# EAGLE design schemat_manipulatora_MTS (EAGLE 9.6.2)
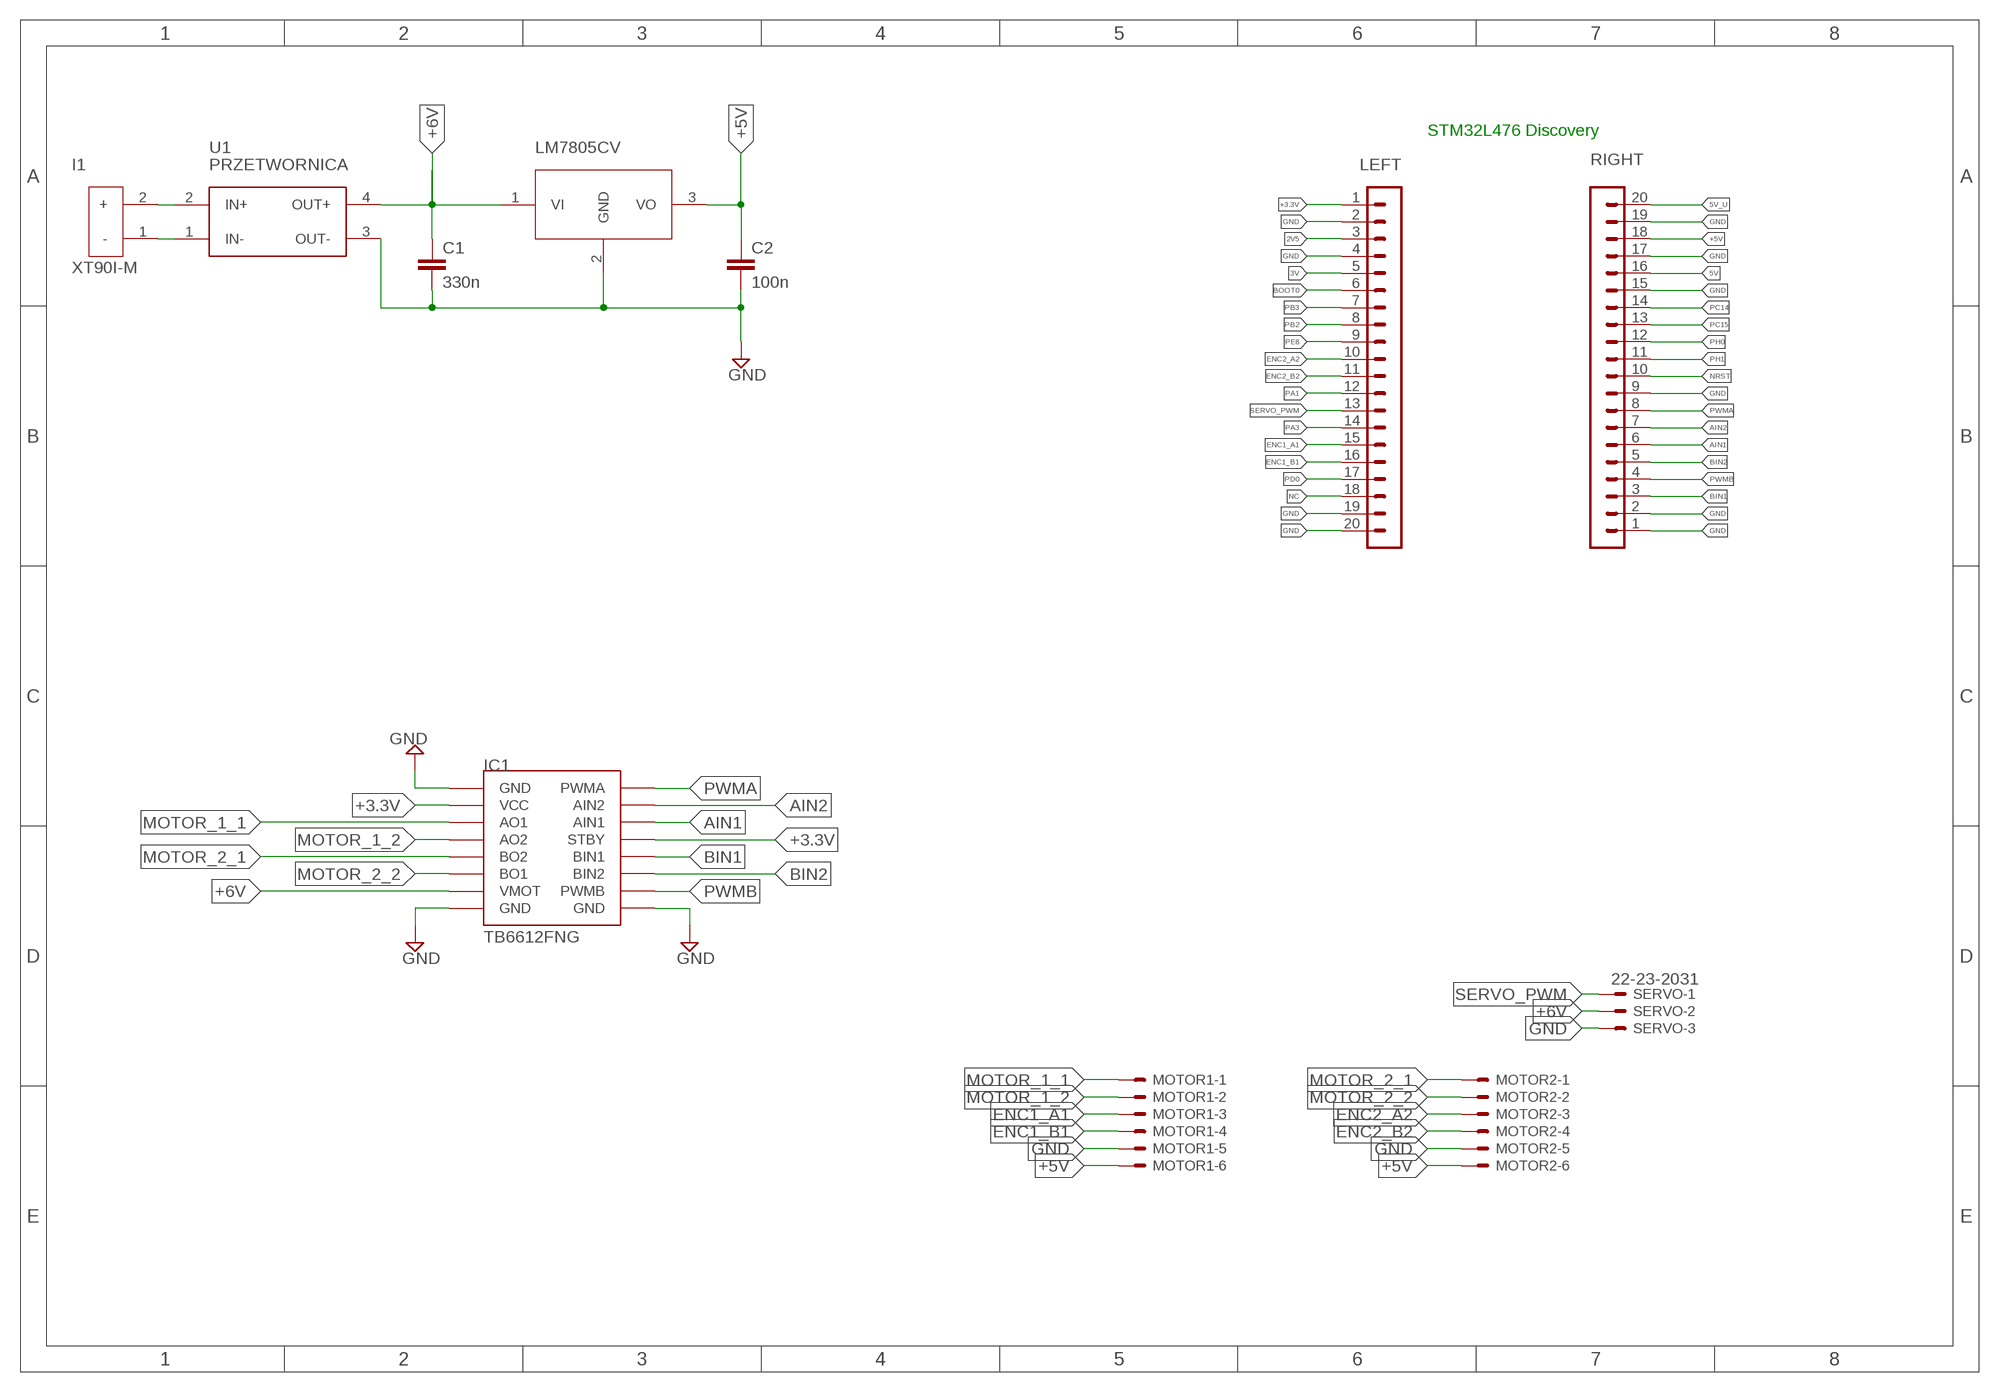
[diagram p0: schematic, sheet 1]

## Parts
C1  330n  C-EU025-024X044  [C025-024X044]
C2  100n  C-EU025-024X044  [C025-024X044]
I1  XT90I-M  [XT90I-M]
IC1  MODUL_POLOLU  [MODUL_POLOLU]
LEFT  MA20-1  [MA20-1]
LM7805CV  LM7805CV  [TO220V]
MOTOR1  22-23-2061  [22-23-2061]
MOTOR2  22-23-2061  [22-23-2061]
RIGHT  MA20-1  [MA20-1]
SERVO  22-23-2031  [22-23-2031]
U1  PRZETWORNICA  [BUCK_MODULE]

## Nets
2V5: LEFT.3
3V: LEFT.5
5V: RIGHT.16
5V_U: RIGHT.20
+3.3V: IC1.STBY IC1.VCC LEFT.1
+5V: C2.1 LM7805CV.3(VO) MOTOR1.6 MOTOR2.6 RIGHT.18
+6V: C1.1 IC1.VMOT LM7805CV.1(VI) SERVO.2 U1.4(OUT+)
AIN1: IC1.AIN1 RIGHT.6
AIN2: IC1.AIN2 RIGHT.7
BIN1: IC1.BIN1 RIGHT.3
BIN2: IC1.BIN2 RIGHT.5
BOOT0: LEFT.6
ENC1_A1: LEFT.15 MOTOR1.3
ENC1_B1: LEFT.16 MOTOR1.4
ENC2_A2: LEFT.10 MOTOR2.3
ENC2_B2: LEFT.11 MOTOR2.4
GND: C1.2 C2.2 IC1.GND1(GND) IC1.GND2(GND) IC1.GND3(GND) LEFT.2 LEFT.4 LEFT.19 LEFT.20 LM7805CV.2(GND) MOTOR1.5 MOTOR2.5 RIGHT.1 RIGHT.2 RIGHT.9 RIGHT.15 RIGHT.17 RIGHT.19 SERVO.3 U1.3(OUT-)
MOTOR_1_1: IC1.AO1 MOTOR1.1
MOTOR_1_2: IC1.A02(AO2) MOTOR1.2
MOTOR_2_1: IC1.BO2 MOTOR2.1
MOTOR_2_2: IC1.BO1 MOTOR2.2
N$1: I1.2(+) U1.2(IN+)
N$2: I1.1(-) U1.1(IN-)
NC: LEFT.18
NRST: RIGHT.10
PA1: LEFT.12
PA3: LEFT.14
PB2: LEFT.8
PB3: LEFT.7
PC14: RIGHT.14
PC15: RIGHT.13
PD0: LEFT.17
PE8: LEFT.9
PH0: RIGHT.12
PH1: RIGHT.11
PWMA: IC1.PWMA RIGHT.8
PWMB: IC1.PWMB RIGHT.4
SERVO_PWM: LEFT.13 SERVO.1

## Notes on the sheet
- STM32L476 Discovery

## Library data of the parts
C1 C2 = rcl:C-EU: CAPACITOR, European symbol; SPICEPREFIX: C
I1 = amy_library:XT90I-M
IC1 = TB6612FNG:MODUL_POLOLU
LEFT RIGHT = con-lstb:MA20-1: PIN HEADER; OC_FARNELL: unknown; OC_NEWARK: unknown
LM7805CV = LM:LM7805CV
MOTOR1 MOTOR2 = con-molex:22-23-2061: .100" (2.54mm) Center Header - 6 Pin; MF: MOLEX; MPN: 22-23-2061; OC_FARNELL: 1462922; OC_NEWARK: 27C1933
SERVO = con-molex:22-23-2031: .100" (2.54mm) Center Header - 3 Pin; MF: MOLEX; MPN: 22-23-2031; OC_FARNELL: 1462950; OC_NEWARK: 30C0862
U1 = LM:PRZETWORNICA

## Module PRZETWORNICA
Ports: 

### Library data of the parts

## Board
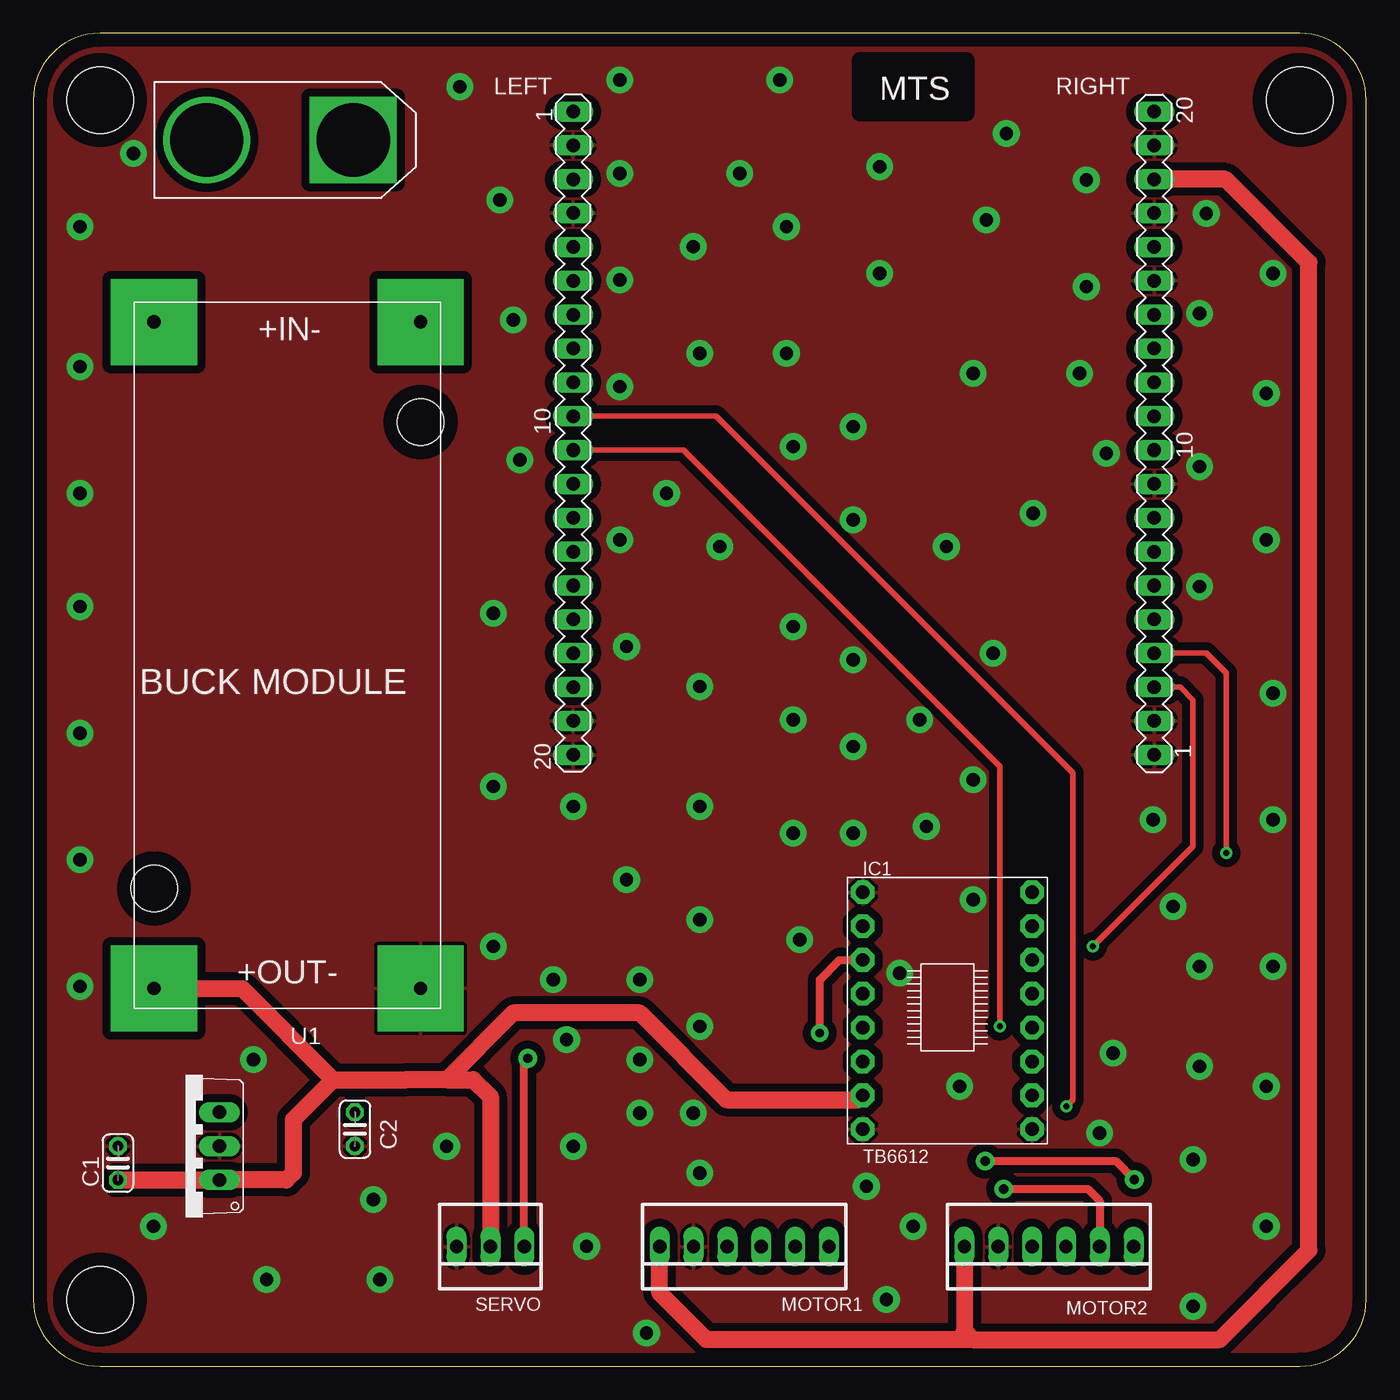
[diagram p1: board, top side]
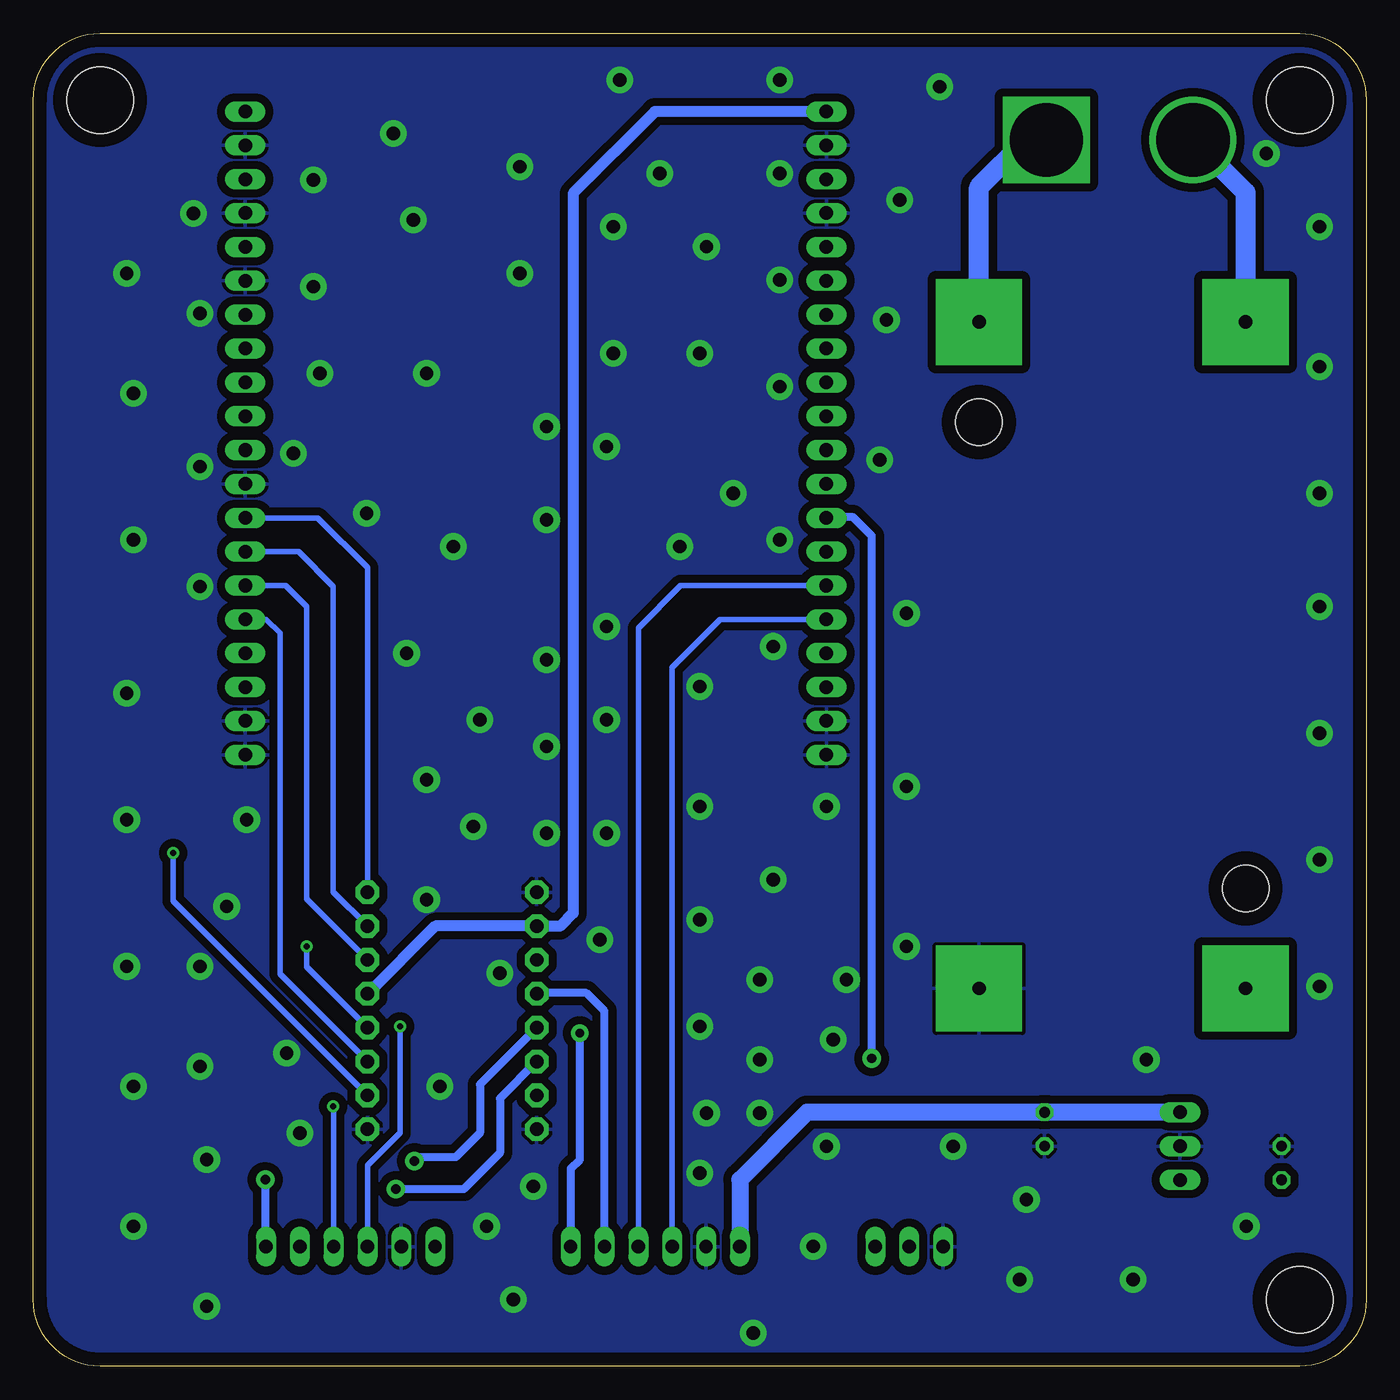
[diagram p2: board, bottom side, seen from below]

Size 100 x 100 mm. Coordinates in mm from the lower left corner, seen from the top.
Outline: 0,95 0,5 arc90 5,0 95,0 arc90 100,5 100,95 arc90 95,100 5,100 arc90 0,95
Copper layers (1*16): Top 0.035mm / dielectric 1.5mm / Bottom 0.035mm
Design rules "default *": minimum track width 6mil, minimum drill 0.35mm, track to track 12mil, track to pad 6mil, pad to pad 6mil, via to via 6mil, smd to smd 6mil, copper to edge 40mil, drill to drill 6mil, minimum pad ring 10mil, minimum via ring 8mil, stop-mask expansion 4mil, vias tented up to drill 100mil, thermal gap 10mil
Holes 5 mm at 5,5 95,95 5,95
tRestrict: area 62,94 to 70,98

### Footprints (pad centres in the part's own frame; a part is rotated, then mirrored left to right if it is on the bottom)
C025-024X044 = drill 0.813 octagon: 1 -1.27,0; 2 1.27,0
XT90I-M = drill 5.5 square: 1 -5.5,0 | drill 5.5: 2 5.5,0
MODUL_POLOLU = drill 1 pad 1.778 octagon: A02 -6.35,1.27; AIN1 6.35,3.81; AIN2 6.35,6.35; AO1 -6.35,3.81; BIN1 6.35,-1.27; BIN2 6.35,-3.81; BO1 -6.35,-3.81; BO2 -6.35,-1.27; GND1 -6.35,8.89; GND2 -6.35,-8.89; GND3 6.35,-8.89; PWMA 6.35,8.89; PWMB 6.35,-6.35; STBY 6.35,1.27; VCC -6.35,6.35; VMOT -6.35,-6.35
MA20-1 = drill 1.016 long: 1 -24.13,0; 2 -21.59,0; 3 -19.05,0; 4 -16.51,0; 5 -13.97,0; 6 -11.43,0; 7 -8.89,0; 8 -6.35,0; 9 -3.81,0; 10 -1.27,0; 11 1.27,0; 12 3.81,0; 13 6.35,0; 14 8.89,0; 15 11.43,0; 16 13.97,0; 17 16.51,0; 18 19.05,0; 19 21.59,0; 20 24.13,0
TO220V = drill 1.016 long: 1 -2.54,-2.54; 2 0,-2.54; 3 2.54,-2.54
22-23-2061 = drill 1 long: 1 -6.35,0; 2 -3.81,0; 3 -1.27,0; 4 1.27,0; 5 3.81,0; 6 6.35,0
22-23-2031 = drill 1 long: 1 -2.54,0; 2 0,0; 3 2.54,0
BUCK_MODULE = drill 1 pad 6.452 square: 1 -10,-25; 2 10,-25; 3 -10,25; 4 10,25 | hole 3.5: -10,-17.5; 10,17.5

### Placement (x,y rotation side)
C1  6.35,15.24 90 top
C2  24.13,17.78 270 top
I1  18.5,92 180 top
IC1  68.58,26.67 0 top
LEFT  40.5,70 270 top
LM7805CV  11.43,16.51 90 top
MOTOR1  53.34,8.97 180 top
MOTOR2  76.2,8.97 180 top
RIGHT  84.1,70 90 top
SERVO  34.29,8.97 180 top
U1  19.05,53.34 180 top

### Tracks (layer width: path | path; a pad name or v marks a point on that pad's centre or on a via)
+3.3V
  Bottom 0.61: 62.21,33 IC1.VCC
  Bottom 0.813: LEFT.1 53.37,94.13 59.5,88 59.5,34 60.5,33 62.21,33 | IC1.VCC 69.85,33.02 IC1.STBY
+5V
  Top 1.27: MOTOR2.6 69.85,2.65 70.5,2 | 70.5,2 89,2 95.7,8.7 95.7,82.8 89.45,89.05 RIGHT.18 | 70.5,2 50.5,2 46.99,5.51 MOTOR1.6
  Bottom 1.27: LM7805CV.3 C2.1 41.95,19.05 47,14 MOTOR1.6
+6V
  Top 1.27: IC1.VMOT 61.91,20 52,20 45.5,26.5 36,26.5 31,21.5 | 22.5,21.5 19.5,18.5 19.5,14.5 18.97,13.97 LM7805CV.1 C1.1 | SERVO.2 34.29,20.21 33,21.5 31,21.5 | U1.4 15.66,28.34 22.5,21.5 | 22.5,21.5 28,21.5 31,21.5
AIN1
  Bottom 0.406: IC1.AIN1 79.5,35.05 79.5,57 81.07,58.57 RIGHT.6
AIN2
  Bottom 0.406: IC1.AIN2 77.5,35.59 77.5,58.5 80.11,61.11 RIGHT.7
BIN1  (via drill 0.45 pad 0.9)
  Top 0.406: v79.5,31.5 87,39 87,50 86.05,50.95 RIGHT.3
  Bottom 0.406: IC1.BIN1 79.5,29.97 v79.5,31.5
BIN2
  Bottom 0.406: IC1.BIN2 81.5,29.43 81.5,55 82.53,56.03 RIGHT.5
ENC1_A1
  Bottom 0.406: MOTOR1.3 54.61,55.39 51.43,58.57 LEFT.15
ENC1_B1
  Bottom 0.406: MOTOR1.4 52.07,52.43 48.47,56.03 LEFT.16
ENC2_A2  (via drill 0.45 pad 0.9)
  Top 0.406: v77.5,19.5 78,20 78,44.5 51.23,71.27 LEFT.10
  Bottom 0.406: MOTOR2.3 77.47,19.47 v77.5,19.5
ENC2_B2  (via drill 0.45 pad 0.9)
  Top 0.406: v72.5,25.5 72.5,45 48.77,68.73 LEFT.11
  Bottom 0.406: MOTOR2.4 74.93,15.07 72.5,17.5 v72.5,25.5
GND  (via drill 1 pad 2)
  other vias: 66,10.5 69.5,21 61.5,46.5 61.5,53 39,29 44,62 57,69 44,73.5 44,89.5 56.5,76 72,53.5 3.5,57 7.5,91 3.5,38 16.5,23 57.5,32 35,87.5 32,96 49.5,84 44,81.5 50,25.5 61.5,40 70.5,44 61.5,70.5 61.5,63.5 93,50.5 64,5 34.5,31.5 34.5,56.5 36.5,68 70.5,35 65,29.5 62.5,13.5 34.5,43.5 3.5,65.5 3.5,75 3.5,85.5 3.5,47.5 3.5,28.5 44,96.5 36,78.5 47.5,65.5 51.5,61.5 66.5,48.5 56.5,85.5 45.5,29 40,24.5 50,14.5 57,40 57,48.5 57,55.5 50,33.5 50,42 50,51 44.5,54 40.5,42 67,40.5 87,4.5 92.5,10.5 92.5,21 93,30 93,41 80,17.5 81,23.5 87.5,30 87.5,22.5 85.5,34.5 84,41 9,10.5 17.5,6.5 26,6.5 25.5,12.5 31,16.5 40.5,16.5 41.5,9 46,2.5 49.5,19 45.5,23 45.5,19 50,76 71.5,86 70.5,74.5 53,89.5 79,81 68.5,61.5 79,89 56,96.5 63.5,90 92.5,62 92.5,73 93,82 88,86.5 87.5,79 87.5,67.5 87.5,58.5 75,64 80.5,68.5 78.5,74.5 63.5,82 44.5,36.5 87,15.5 73,92.5
  pour Top (isolate 0.61): -7,111 -9,109 -9,-10 102.5,-10 112,-0.5 112,109.5 110,111.5
  pour Bottom (isolate 0.61): -10,101 -10,-6 -6.5,-9.5 99,-9.5 113.5,5 113.5,95.5 99.5,109.5 -1.5,109.5
MOTOR_1_1  (via drill 0.65 pad 1.3)
  Top 0.61: v59,25 59,29 60.48,30.48 IC1.AO1
  Bottom 0.61: MOTOR1.1 59.69,14.81 59,15.5 v59,25
MOTOR_1_2
  Bottom 0.61: MOTOR1.2 57.15,18 57.15,26.65 58.5,28 62.17,28 IC1.A02
MOTOR_2_1  (via drill 0.7 pad 1.4)
  Top 0.61: v71.4,15.4 75.5,15.4 81.2,15.4 v82.6,14
  Bottom 0.61: IC1.BO2 66.5,21.13 66.5,17.5 68.3,15.7 71.1,15.7 v71.4,15.4 | v82.6,14 82.6,9.02 MOTOR2.1
MOTOR_2_2  (via drill 0.7 pad 1.4)
  Top 0.61: v72.8,13.3 79.1,13.3 80.01,12.39 MOTOR2.2
  Bottom 0.61: IC1.BO1 65,20.09 65,16 67.7,13.3 v72.8,13.3
N$1
  Bottom 1.5: I1.2 9.05,88.05 U1.2
N$2
  Bottom 1.5: U1.1 29.05,88.45 25.5,92 I1.1
PWMA
  Bottom 0.406: IC1.PWMA 74.93,59.93 78.65,63.65 RIGHT.8
PWMB  (via drill 0.45 pad 0.9)
  Top 0.406: v89.5,38.5 89.5,52 88,53.5 RIGHT.4
  Bottom 0.406: IC1.PWMB 89.5,34.89 v89.5,38.5
SERVO_PWM  (via drill 0.7 pad 1.4)
  Top 0.61: SERVO.1 36.83,22.83 v37.1,23.1
  Bottom 0.61: v37.1,23.1 37.1,62.3 38.5,63.7 40.45,63.7 LEFT.13

### Text on the board
Top: MTS
tNames: MTS